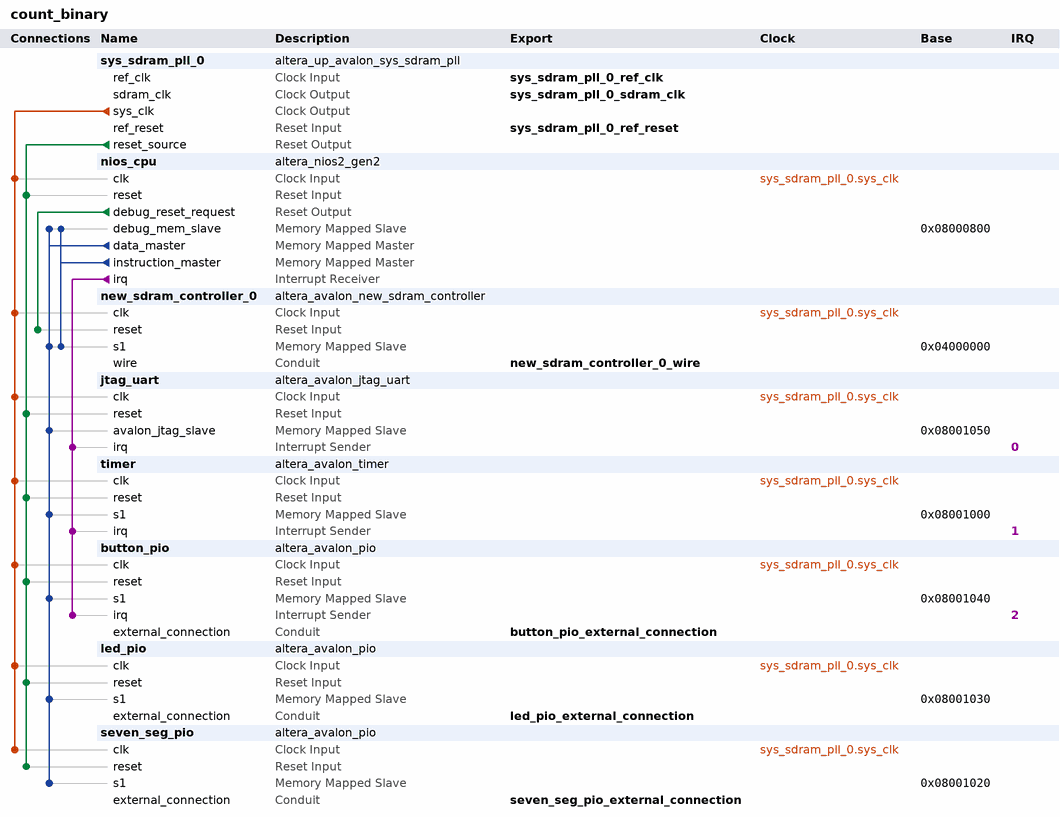
[diagram p0: system contents]
# Platform Designer (Qsys) system count_binary, Cyclone V 5CSEMA5F31C6
# Parameters at their usual value, and those the tool derives, are not listed.
package require -exact qsys 18.1
create_system count_binary
set_project_property DEVICE_FAMILY {Cyclone V}
set_project_property DEVICE 5CSEMA5F31C6

add_instance sys_sdram_pll_0 altera_up_avalon_sys_sdram_pll 18.0
set_instance_parameter_value sys_sdram_pll_0 CV_boards DE10-Standard
set_instance_parameter_value sys_sdram_pll_0 gui_outclk 50.0
set_instance_parameter_value sys_sdram_pll_0 gui_refclk 50.0

add_instance nios_cpu altera_nios2_gen2 18.1
set_instance_parameter_value nios_cpu dcache_size 2048
set_instance_parameter_value nios_cpu exceptionSlave new_sdram_controller_0.s1
set_instance_parameter_value nios_cpu icache_size 4096
set_instance_parameter_value nios_cpu impl Tiny
set_instance_parameter_value nios_cpu resetSlave new_sdram_controller_0.s1

add_instance new_sdram_controller_0 altera_avalon_new_sdram_controller 18.1
set_instance_parameter_value new_sdram_controller_0 TAC 5.5
set_instance_parameter_value new_sdram_controller_0 TRCD 20.0
set_instance_parameter_value new_sdram_controller_0 TRP 20.0
set_instance_parameter_value new_sdram_controller_0 casLatency 3
set_instance_parameter_value new_sdram_controller_0 columnWidth 10
set_instance_parameter_value new_sdram_controller_0 dataWidth 16
set_instance_parameter_value new_sdram_controller_0 generateSimulationModel false
set_instance_parameter_value new_sdram_controller_0 model single_Micron_MT48LC4M32B2_7_chip
set_instance_parameter_value new_sdram_controller_0 numberOfBanks 4
set_instance_parameter_value new_sdram_controller_0 numberOfChipSelects 1
set_instance_parameter_value new_sdram_controller_0 powerUpDelay 100.0
set_instance_parameter_value new_sdram_controller_0 refreshPeriod 15.625
set_instance_parameter_value new_sdram_controller_0 rowWidth 13

add_instance jtag_uart altera_avalon_jtag_uart 18.1
set_instance_parameter_value jtag_uart simInteractiveOptions NO_INTERACTIVE_WINDOWS

add_instance timer altera_avalon_timer 18.1
set_instance_parameter_value timer period 125
set_instance_parameter_value timer periodUnits MSEC

add_instance button_pio altera_avalon_pio 18.1
set_instance_parameter_value button_pio captureEdge true
set_instance_parameter_value button_pio direction Input
set_instance_parameter_value button_pio generateIRQ true
set_instance_parameter_value button_pio irqType EDGE
set_instance_parameter_value button_pio width 4

add_instance led_pio altera_avalon_pio 18.1
set_instance_parameter_value led_pio direction Output
set_instance_parameter_value led_pio width 8

add_instance seven_seg_pio altera_avalon_pio 18.1
set_instance_parameter_value seven_seg_pio direction Output
set_instance_parameter_value seven_seg_pio width 16

# connections
add_connection sys_sdram_pll_0.sys_clk button_pio.clk clock
add_connection sys_sdram_pll_0.sys_clk jtag_uart.clk clock
add_connection sys_sdram_pll_0.sys_clk led_pio.clk clock
add_connection sys_sdram_pll_0.sys_clk new_sdram_controller_0.clk clock
add_connection sys_sdram_pll_0.sys_clk nios_cpu.clk clock
add_connection sys_sdram_pll_0.sys_clk seven_seg_pio.clk clock
add_connection sys_sdram_pll_0.sys_clk timer.clk clock
add_connection nios_cpu.debug_reset_request new_sdram_controller_0.reset reset
add_connection sys_sdram_pll_0.reset_source button_pio.reset reset
add_connection sys_sdram_pll_0.reset_source jtag_uart.reset reset
add_connection sys_sdram_pll_0.reset_source led_pio.reset reset
add_connection sys_sdram_pll_0.reset_source nios_cpu.reset reset
add_connection sys_sdram_pll_0.reset_source seven_seg_pio.reset reset
add_connection sys_sdram_pll_0.reset_source timer.reset reset
add_connection nios_cpu.data_master button_pio.s1 avalon
set_connection_parameter_value nios_cpu.data_master/button_pio.s1 baseAddress 0x08001040
add_connection nios_cpu.data_master jtag_uart.avalon_jtag_slave avalon
set_connection_parameter_value nios_cpu.data_master/jtag_uart.avalon_jtag_slave baseAddress 0x08001050
add_connection nios_cpu.data_master led_pio.s1 avalon
set_connection_parameter_value nios_cpu.data_master/led_pio.s1 baseAddress 0x08001030
add_connection nios_cpu.data_master new_sdram_controller_0.s1 avalon
set_connection_parameter_value nios_cpu.data_master/new_sdram_controller_0.s1 baseAddress 0x04000000
add_connection nios_cpu.data_master nios_cpu.debug_mem_slave avalon
set_connection_parameter_value nios_cpu.data_master/nios_cpu.debug_mem_slave baseAddress 0x08000800
add_connection nios_cpu.data_master seven_seg_pio.s1 avalon
set_connection_parameter_value nios_cpu.data_master/seven_seg_pio.s1 baseAddress 0x08001020
add_connection nios_cpu.data_master timer.s1 avalon
set_connection_parameter_value nios_cpu.data_master/timer.s1 baseAddress 0x08001000
add_connection nios_cpu.instruction_master new_sdram_controller_0.s1 avalon
set_connection_parameter_value nios_cpu.instruction_master/new_sdram_controller_0.s1 baseAddress 0x04000000
add_connection nios_cpu.instruction_master nios_cpu.debug_mem_slave avalon
set_connection_parameter_value nios_cpu.instruction_master/nios_cpu.debug_mem_slave baseAddress 0x08000800
add_connection nios_cpu.irq button_pio.irq interrupt
set_connection_parameter_value nios_cpu.irq/button_pio.irq irqNumber 2
add_connection nios_cpu.irq jtag_uart.irq interrupt
set_connection_parameter_value nios_cpu.irq/jtag_uart.irq irqNumber 0
add_connection nios_cpu.irq timer.irq interrupt
set_connection_parameter_value nios_cpu.irq/timer.irq irqNumber 1

# exported interfaces
add_interface button_pio_external_connection conduit end
set_interface_property button_pio_external_connection EXPORT_OF button_pio.external_connection
add_interface led_pio_external_connection conduit end
set_interface_property led_pio_external_connection EXPORT_OF led_pio.external_connection
add_interface new_sdram_controller_0_wire conduit end
set_interface_property new_sdram_controller_0_wire EXPORT_OF new_sdram_controller_0.wire
add_interface seven_seg_pio_external_connection conduit end
set_interface_property seven_seg_pio_external_connection EXPORT_OF seven_seg_pio.external_connection
add_interface sys_sdram_pll_0_ref_clk clock sink
set_interface_property sys_sdram_pll_0_ref_clk EXPORT_OF sys_sdram_pll_0.ref_clk
add_interface sys_sdram_pll_0_ref_reset reset sink
set_interface_property sys_sdram_pll_0_ref_reset EXPORT_OF sys_sdram_pll_0.ref_reset
add_interface sys_sdram_pll_0_sdram_clk clock source
set_interface_property sys_sdram_pll_0_sdram_clk EXPORT_OF sys_sdram_pll_0.sdram_clk

set_interconnect_requirement {$system} qsys_mm.clockCrossingAdapter HANDSHAKE
set_interconnect_requirement {$system} qsys_mm.enableEccProtection FALSE
set_interconnect_requirement {$system} qsys_mm.insertDefaultSlave FALSE
set_interconnect_requirement {$system} qsys_mm.maxAdditionalLatency 1

save_system count_binary.qsys
